# EAGLE design controller (EAGLE 6.4)
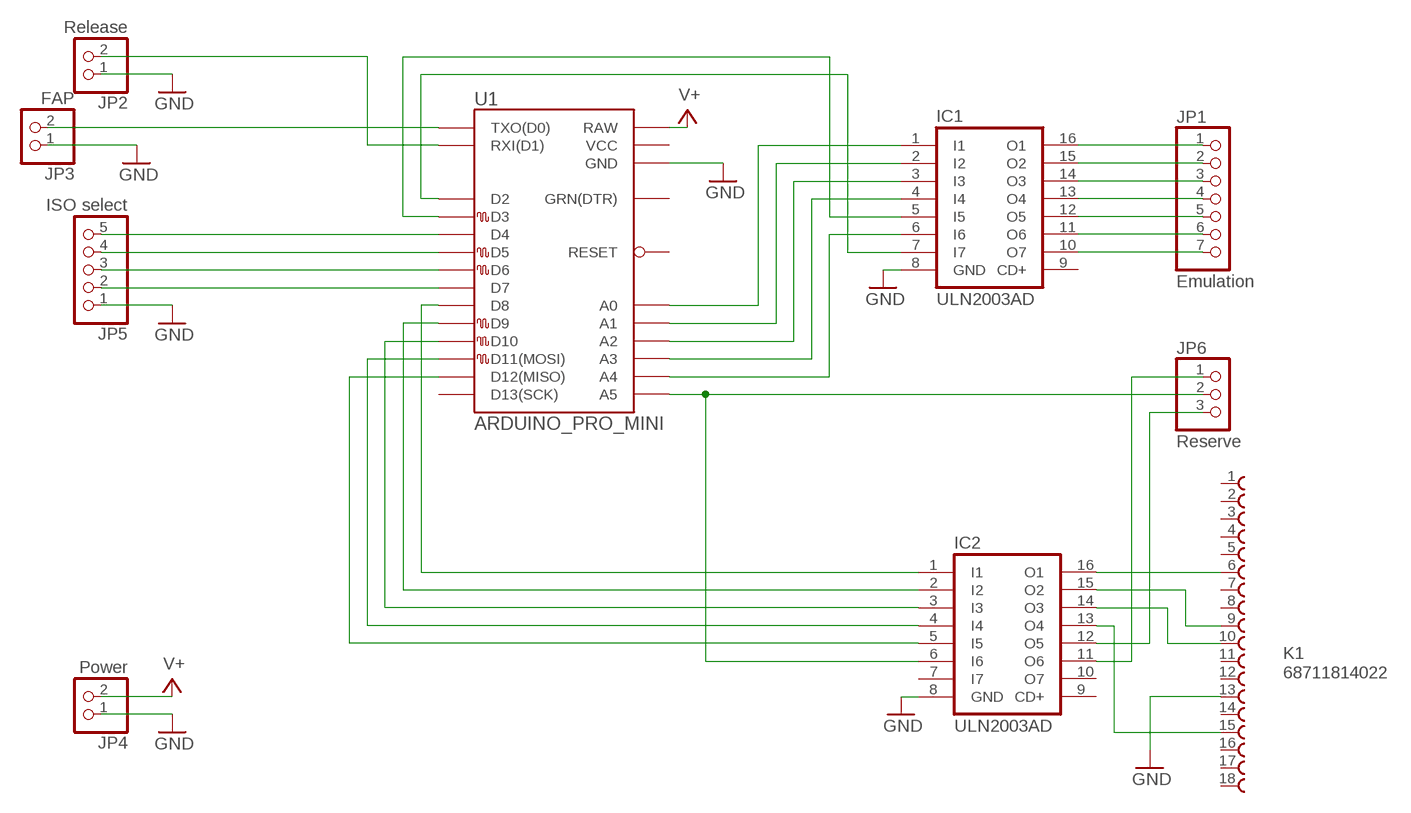
[diagram p0: schematic, sheet 1]

## Parts
IC1  ULN2003AD  [SO16]
IC2  ULN2003AD  [SO16]
JP1  Emulation  PINHD-1X7/90  [1X07/90]
JP2  Release  PINHD-1X2  [1X02]
JP3  FAP  PINHD-1X2  [1X02]
JP4  Power  PINHD-1X2  [1X02]
JP5  ISO select  PINHD-1X5/90  [1X05/90]
JP6  Reserve  PINHD-1X3  [1X03]
K1  68711814022  [68711814022]
U1  ARDUINO_PRO_MINI  [ARDUINO_PRO_MINI]

## Nets
GND: IC1.8(GND) IC2.8(GND) JP2.1 JP3.1 JP4.1 JP5.1 K1.13 U1.GND1(GND)
N$1: IC1.1(I1) U1.A0
N$2: IC1.2(I2) U1.A1
N$3: IC1.3(I3) U1.A2
N$4: IC1.4(I4) U1.A3
N$5: IC1.5(I5) U1.D3
N$6: IC1.6(I6) U1.A4
N$7: IC1.7(I7) U1.D2
N$8: IC2.1(I1) U1.D8
N$9: IC2.2(I2) U1.D9
N$10: IC2.3(I3) U1.D10
N$11: IC2.4(I4) U1.D11(D11(MOSI))
N$12: IC2.5(I5) U1.D12(D12(MISO))
N$13: JP5.5 U1.D4
N$14: JP5.4 U1.D5
N$15: JP5.3 U1.D6
N$16: JP5.2 U1.D7
N$17: JP3.2 U1.TXO(TXO(D0))
N$18: JP2.2 U1.RXI(RXI(D1))
N$19: IC2.6(I6) JP6.2 U1.A5
N$20: IC1.16(O1) JP1.1
N$21: IC1.15(O2) JP1.2
N$22: IC1.14(O3) JP1.3
N$23: IC1.13(O4) JP1.4
N$24: IC1.12(O5) JP1.5
N$25: IC1.11(O6) JP1.6
N$26: IC1.10(O7) JP1.7
N$27: IC2.11(O6) JP6.1
N$28: IC2.16(O1) K1.6
N$29: IC2.15(O2) K1.9
N$30: IC2.14(O3) K1.10
N$31: IC2.13(O4) K1.15
N$32: IC2.12(O5) JP6.3
V+: JP4.2 U1.RAW
Unconnected: IC1.9(CD+) IC2.7(I7) IC2.9(CD+) IC2.10(O7) K1.1 K1.2 K1.3 K1.4 K1.5 K1.7 K1.8 K1.11 K1.12 K1.14 K1.16 K1.17 K1.18 U1.D13(D13(SCK)) U1.GRN(GRN(DTR)) U1.RST1(RESET) U1.VCC1(VCC)

## Library data of the parts
IC1 IC2 = uln-udn:ULN2003A: DRIVER ARRAY
JP1 = pinhead:PINHD-1X7: PIN HEADER
JP2-JP4 = pinhead:PINHD-1X2: PIN HEADER
JP5 = pinhead:PINHD-1X5: PIN HEADER
JP6 = pinhead:PINHD-1X3: PIN HEADER
K1 = Wuerth_Elektronik_eiCan_03_ZIF_Connectors_Flat_Flexible_Cable:68711814022: WR-FPC 0.5mm SMT ZIF Horizontal Top Contact, 18 Pins
U1 = Halley.rpt:ARDUINO_PRO_MINI

## Net classes
0 default: width 0.279 mm, drill 0.381 mm, clearance 0.152 mm

## Board
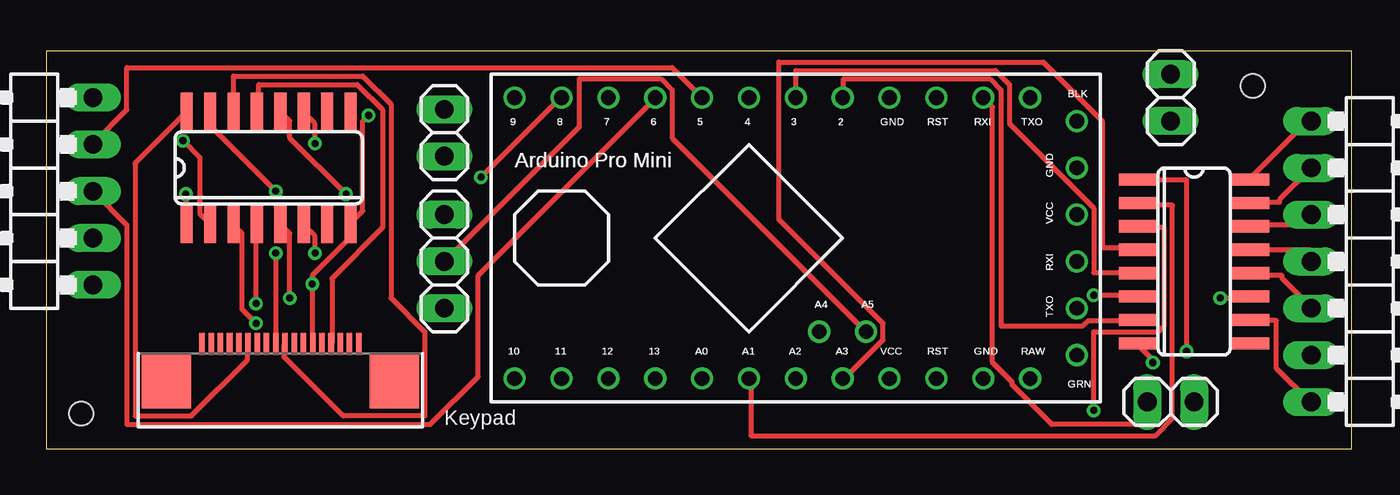
[diagram p1: board, top side]
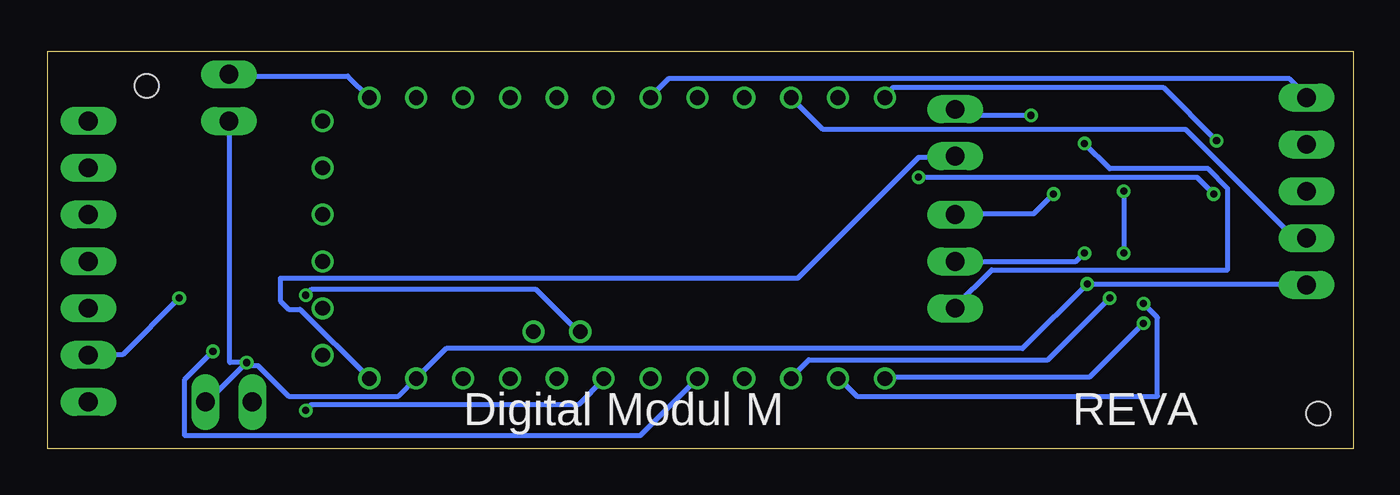
[diagram p2: board, bottom side, seen from below]

Size 70.79 x 21.58 mm. Coordinates in mm from the lower left corner, seen from the top.
Outline: 0,0 70.79,0 70.79,21.58 0,21.58 0,0
Copper layers (1*16): Top 0.0356mm / dielectric 1.5011mm / Bottom 0.0356mm
Design rules "LaenPCBOrder": minimum track width 6mil, minimum drill 13mil, track to track 6mil, track to pad 6mil, pad to pad 6mil, via to via 6mil, smd to smd 6mil, copper to edge 15mil, drill to drill 6mil, minimum pad ring 7mil, minimum via ring 7mil, stop-mask expansion 4mil, vias tented up to drill 0mil, thermal gap 10mil
Holes 1.3 mm at 1.91,1.91 65.41,19.69

### Footprints (pad centres in the part's own frame; a part is rotated, then mirrored left to right if it is on the bottom)
SO16 = smd 0.66 x 2.032: 1 -4.445,-3.073; 2 -3.175,-3.073; 3 -1.905,-3.073; 4 -0.635,-3.073; 5 0.635,-3.073; 6 1.905,-3.073; 7 3.175,-3.073; 8 4.445,-3.073; 9 4.445,3.073; 10 3.175,3.073; 11 1.905,3.073; 12 0.635,3.073; 13 -0.635,3.073; 14 -1.905,3.073; 15 -3.175,3.073; 16 -4.445,3.073
1X07/90 = drill 1.016 long: 1 -7.62,-3.81; 2 -5.08,-3.81; 3 -2.54,-3.81; 4 0,-3.81; 5 2.54,-3.81; 6 5.08,-3.81; 7 7.62,-3.81
1X02 = drill 1.016 long: 1 -1.27,0; 2 1.27,0
1X05/90 = drill 1.016 long: 1 -5.08,-3.81; 2 -2.54,-3.81; 3 0,-3.81; 4 2.54,-3.81; 5 5.08,-3.81
1X03 = drill 1.016 long: 1 -2.54,0; 2 0,0; 3 2.54,0
68711814022 = smd 0.3 x 1.2: 1 -4.25,0.6; 2 -3.75,0.6; 3 -3.25,0.6; 4 -2.75,0.6; 5 -2.25,0.6; 6 -1.75,0.6; 7 -1.25,0.6; 8 -0.75,0.6; 9 -0.25,0.6; 10 0.25,0.6; 11 0.75,0.6; 12 1.25,0.6; 13 1.75,0.6; 14 2.25,0.6; 15 2.75,0.6; 16 3.25,0.6; 17 3.75,0.6; 18 4.25,0.6 | smd 2.7 x 3: 19 -6.18,-1.38; 20 6.18,-1.38
ARDUINO_PRO_MINI = drill 0.8: A0 -6.35,-7.62; A1 -3.81,-7.62; A2 -1.27,-7.62; A3 1.27,-7.62; A4 0,-5.08; A5 2.54,-5.08; BLK 13.97,6.35; D2 1.27,7.62; D3 -1.27,7.62; D4 -3.81,7.62; D5 -6.35,7.62; D6 -8.89,7.62; D7 -11.43,7.62; D8 -13.97,7.62; D9 -16.51,7.62; D10 -16.51,-7.62; D11 -13.97,-7.62; D12 -11.43,-7.62; D13 -8.89,-7.62; GND1 8.89,-7.62; GND2 3.81,7.62; GND3 13.97,3.81; GRN 13.97,-6.35; RAW 11.43,-7.62; RST1 6.35,-7.62; RST2 6.35,7.62; RXI 8.89,7.62; RXI2 13.97,-1.27; TXO 11.43,7.62; TXO2 13.97,-3.81; VCC1 3.81,-7.62; VCC2 13.97,1.27

### Placement (x,y rotation side)
IC1  62.23,10.16 270 top
IC2  12.06,15.24 0 top
JP1  72.39,10.16 270 top
JP2  60.96,2.54 180 top
JP3  60.96,19.05 90 top
JP4  21.59,17.14 270 top
JP5  -1.27,13.97 90 top
JP6  21.59,10.16 90 top
K1  12.7,5.08 0 top
U1  41.91,11.43 0 top

### Tracks (layer width: path | path; a pad name or v marks a point on that pad's centre or on a via)
GND  (via drill 0.38)
  Top 0.279: v60,4.67 60,4.83 59.23,5.59 IC1.8 | K1.13 14.43,5.74 v14.43,8.94 14.43,9.4 16.41,11.38 16.41,12.14 IC2.8 16.56,12.29 17.17,12.9 17.17,17.78 v17.48,18.08
  Bottom 0.279: v60,4.67 62.13,2.54 JP2.1 | v60,4.67 60,4.52 59.39,4.52 57.71,2.84 51.77,2.84 U1.GND1 49.17,5.44 17.93,5.44 v14.43,8.94 2.54,8.94 JP5.1 | v60,4.67 60.91,4.67 60.91,17.78 JP3.1 | v17.48,18.08 21.28,18.08 21.59,18.39 JP4.1
N$1  (via drill 0.38)
  Top 0.279: v61.82,5.28 61.82,14.58 59.23,14.58 IC1.1
  Bottom 0.279: v61.82,5.28 63.35,3.76 63.35,0.71 38.66,0.71 U1.A0
N$2
  Top 0.279: IC1.2 59.23,13.21 61.06,13.21 61.06,1.63 60.15,0.71 38.2,0.71 38.2,3.76 U1.A1
N$3  (via drill 0.38)
  Top 0.279: v56.79,2.08 56.79,6.35 60.3,6.35 60.6,6.66 60.6,11.99 59.23,11.99 IC1.3
  Bottom 0.279: v56.79,2.08 56.49,2.39 42.01,2.39 40.64,3.76 U1.A2
N$4
  Top 0.279: IC1.4 59.08,10.92 57.25,10.92 57.25,17.78 54.05,20.98 39.73,20.98 39.73,12.45 45.36,6.81 45.36,5.89 43.23,3.76 U1.A3
N$5
  Top 0.279: U1.D3 40.64,20.52 51.46,20.52 52.22,19.76 52.22,17.63 56.79,13.06 56.79,9.55 59.08,9.55 IC1.5
N$6  (via drill 0.38)
  Top 0.279: v56.79,8.33 59.08,8.33 IC1.6
  Bottom 0.279: v56.79,8.33 56.49,8.64 44.3,8.64 42.01,6.35 U1.A4
N$7
  Top 0.279: IC1.7 59.08,6.96 56.49,6.96 56.19,6.66 51.77,6.66 51.77,19.46 51.16,20.07 43.23,20.07 43.23,19.15 U1.D2
N$8  (via drill 0.38)
  Top 0.279: v7.57,13.82 7.57,12.29 IC2.1 | v23.57,14.73 27.84,19 U1.D8
  Bottom 0.279: v7.57,13.82 8.48,14.73 v23.57,14.73
N$9  (via drill 0.38)
  Top 0.279: v7.42,16.71 8.33,15.8 8.33,12.75 8.79,12.29 IC2.2
  Bottom 0.279: v7.42,16.71 10.31,19.61 24.94,19.61 25.4,19.15 U1.D9
N$10  (via drill 0.38)
  Top 0.279: v11.38,6.81 10.62,7.57 10.62,11.68 10.16,12.14 IC2.3
  Bottom 0.279: v11.38,6.81 14.28,3.91 25.4,3.91 U1.D10
N$11  (via drill 0.38)
  Top 0.279: v11.38,7.87 11.38,12.14 IC2.4
  Bottom 0.279: v11.38,7.87 10.62,7.11 10.62,2.84 26.92,2.84 27.84,3.76 U1.D11
N$12  (via drill 0.38)
  Top 0.279: v13.21,8.18 13.21,11.68 12.75,12.14 IC2.5
  Bottom 0.279: v13.21,8.18 16.56,4.83 29.52,4.83 30.43,3.91 U1.D12
N$13
  Bottom 0.279: U1.D4 38.05,19.15 37.14,20.07 3.45,20.07 2.54,19.15 JP5.5
N$14
  Top 0.279: U1.D5 33.93,20.68 4.37,20.68 4.37,18.39 2.54,16.56 JP5.4
N$15
  Top 0.279: JP5.3 4.37,12.14 4.37,1.32 20.83,1.32 23.42,3.91 23.42,9.4 33.02,19 U1.D6
N$16
  Bottom 0.279: U1.D7 28.75,17.32 9.09,17.32 3.3,11.53 2.54,11.53 JP5.2
N$17
  Bottom 0.279: U1.TXO 54.51,20.22 60.91,20.22 JP3.2
N$18
  Top 0.279: U1.RXI 51.31,18.54 51.31,4.67 52.38,3.61 52.38,3.45 54.51,1.32 59.69,1.32 JP2.2
N$19  (via drill 0.38)
  Top 0.279: v14.58,10.62 14.58,11.53 13.97,12.14 IC2.6 | U1.A5 33.93,16.87 33.93,19.46 33.33,20.07 28.91,20.07 28.91,17.47 JP6.2
  Bottom 0.279: v14.58,10.62 15.04,10.16 JP6.2
N$20
  Top 0.279: JP1.1 68.38,17.78 65.33,14.73 IC1.16
N$21
  Top 0.279: JP1.2 66.85,13.51 66.85,13.36 65.33,13.36 IC1.15
N$22
  Top 0.279: IC1.14 65.33,12.14 68.53,12.14 68.53,12.6 JP1.3
N$23
  Top 0.279: IC1.13 65.33,10.77 68.53,10.77 68.53,10.16 JP1.4
N$24
  Top 0.279: IC1.12 65.33,9.4 67,9.4 67,9.25 68.53,7.72 JP1.5
N$25  (via drill 0.38)
  Top 0.279: v63.65,8.18 65.18,8.18 IC1.11
  Bottom 0.279: v63.65,8.18 66.7,5.13 68.53,5.13 JP1.6
N$26
  Top 0.279: IC1.10 65.33,6.96 66.7,6.96 66.7,4.37 68.53,2.54 JP1.7
N$27  (via drill 0.38)
  Top 0.279: v14.58,16.56 14.58,17.63 13.97,18.24 IC2.11
  Bottom 0.279: v14.58,16.56 13.21,15.19 7.87,15.19 6.81,14.12 6.81,9.7 19.61,9.7 21.59,7.72 JP6.1
N$28
  Top 0.279: K1.6 10.92,5.59 10.92,4.83 7.87,1.78 4.83,1.78 4.83,15.49 7.57,18.24 IC2.16
N$29  (via drill 0.38)
  Top 0.279: v12.45,10.62 12.45,5.74 K1.9 | v12.45,13.97 8.94,17.47 8.94,18.24 IC2.15
  Bottom 0.279: v12.45,13.97 v12.45,10.62
N$30
  Top 0.279: IC2.14 10.16,20.22 17.17,20.22 18.69,18.69 18.69,8.18 20.52,6.35 20.52,1.78 16.1,1.78 12.9,4.98 12.9,5.59 K1.10
N$31
  Top 0.279: K1.15 15.49,5.74 15.49,9.25 18.24,11.99 18.24,18.39 16.87,19.76 11.53,19.76 11.53,18.39 IC2.13
N$32  (via drill 0.38)
  Top 0.279: v16.26,13.82 13.21,16.87 13.21,17.78 12.75,18.24 IC2.12
  Bottom 0.279: v16.26,13.82 17.32,12.75 21.59,12.75 JP6.3
V+
  Bottom 0.279: U1.RAW 57.1,7.57 57.71,7.57 58.17,8.03 58.17,9.25 30.12,9.25 23.57,15.8 21.59,15.8 JP4.2

### Text on the board
tNames: Keypad
bNames: REVA | Digital Modul M
_tplace: BLK | BLK | 9 | 9 | 8 | 8 | 7 | 7 | 6 | 6 | 5 | 5 | 4 | 4 | 3 | 3 | 2 | 2 | GND | GND | RST | RST | RXI | RXI | TXO | TXO | Arduino Pro Mini | Arduino Pro Mini | GND | GND | VCC | VCC | RXI | RXI | A4 | A4 | A5 | A5 | TXO | TXO | 10 | 10 | 11 | 11 | 12 | 12 | 13 | 13 | A0 | A0 | A1 | A1 | A2 | A2 | A3 | A3 | VCC | VCC | RST | RST | GND | GND | RAW | RAW | GRN | GRN